# Altium project sar19-coral-connector.PrjPcb
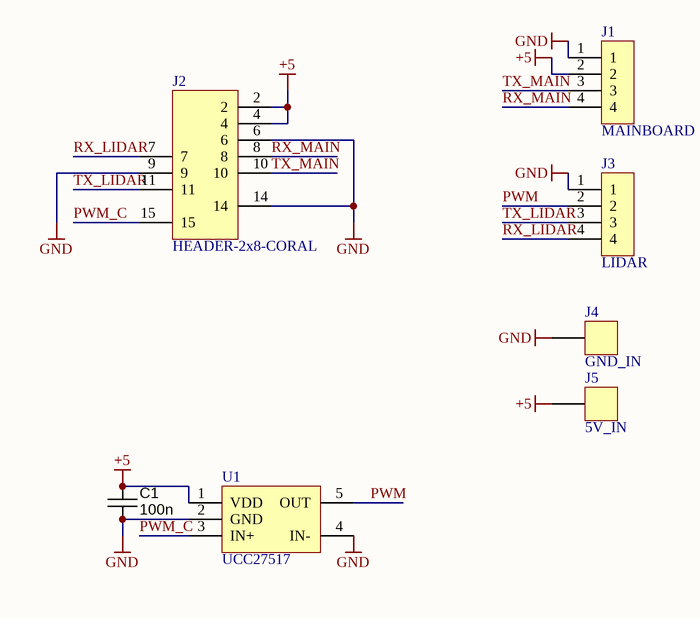
[diagram p0: sar19-coral-connector.SchDoc]
1 sheet, 7 parts. Net scope: global (net labels, ports and power ports of the same name join across sheets).
Board file: sar19-coral-connector.PcbDoc

## Sheet sar19-coral-connector.SchDoc
size A4

### Parts
C1  100n  [CAPC1608X90N]
J1  MAINBOARD  [MICRO-MATCH-FOB-SIDE-04]
J2  HEADER-2x8-CORAL  [PIN-HEADER-2x8-CORAL]
J3  LIDAR  [MICRO-MATCH-FOB-SIDE-04]
J4  GND_IN  [POWER-PAD-4x3]
J5  5V_IN  [POWER-PAD-4x3]
U1  UCC27517  [SOT23-5]

### Nets
+5: C1.1 J1.2 J2.2 J2.4 J5.1 U1.1(VDD)
GND: C1.2 J1.1 J2.6 J2.9 J2.14 J3.1 J4.1 U1.2(GND) U1.4(IN-)
PWM: J3.2 U1.5(OUT)
PWM_C: J2.15 U1.3(IN+)
RX_LIDAR: J2.7 J3.4
RX_MAIN: J1.4 J2.8
TX_LIDAR: J2.11 J3.3
TX_MAIN: J1.3 J2.10

### Library data of the parts
C1 = CAPC_100n_0603_X7R_50V_10%: Capacitor SMD Cer 100nF 10% 50V X7R 0603; Manufacturer 1: AVX Corporation; Manufacturer Part Number 1: 06035C104KAT2A; Ratings: 50V; X7R; Material: ceramic; SCDType: spec; Manufacturer 2: TDK Corporation; Manufacturer Part Number 2: C1608X7R1H104K; Package / Case: 0603 (1608 Metric); Tolerance: ±10%; Supplier 1: Digi-Key; Supplier Part Number 1: 478-5052-1-ND; ComponentLink1URL: http://www.avx.com/docs/Catalogs/cx7r.pdf; ComponentLink1Description: http://www.avx.com/docs/Catalogs/cx7r.pdf; Supplier 2: Digi-Key; Supplier Part Number 2: 445-1314-1-ND; ComponentLink2URL: http://product.tdk.com/capacitor/mlcc/en/documents/mlcc_commercial_general_en.pdf; ComponentLink2Description: http://product.tdk.com/capacitor/mlcc/en/documents/mlcc_commercial_general_en.pdf; Value: 100n
J1 J3 = HEADER-4
J4 J5 = HEADER-1